# Altium project SLW_2018_V1.PrjPcb
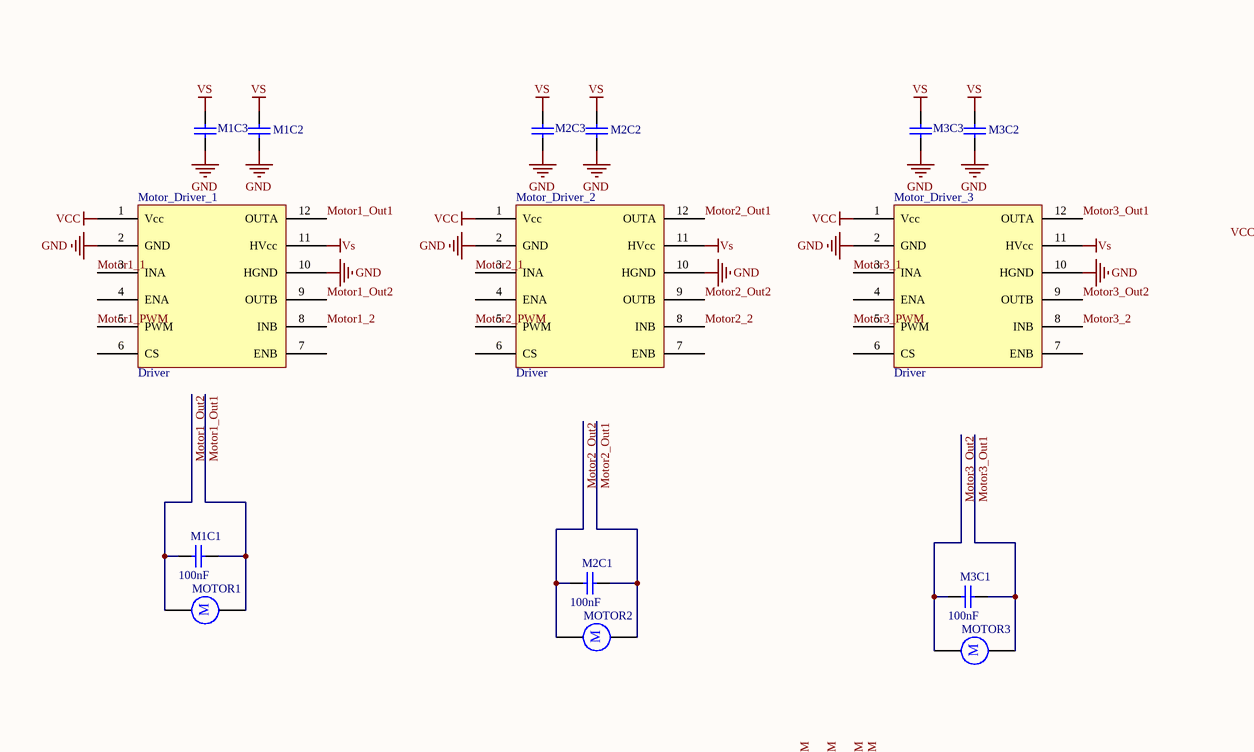
[diagram p0: SLW_2018_V1.SchDoc, top left]
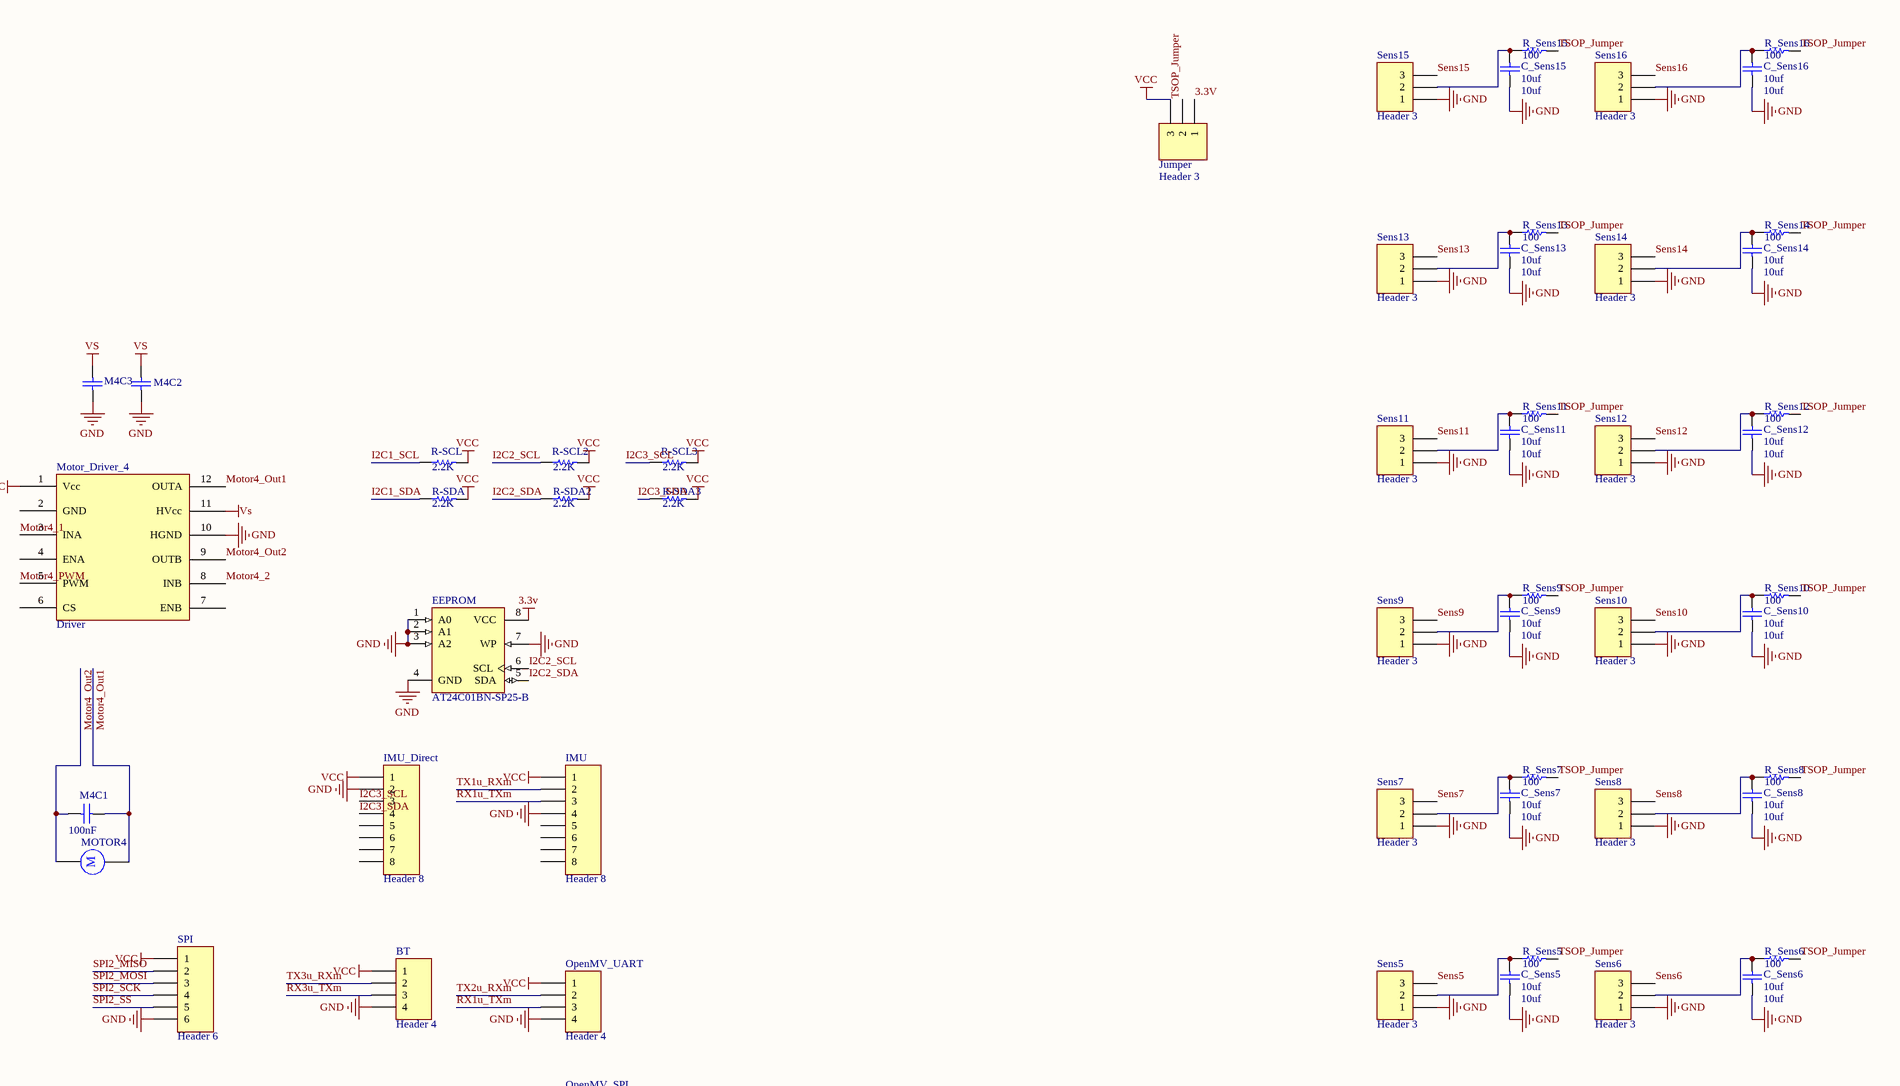
[diagram p1: SLW_2018_V1.SchDoc, top right]
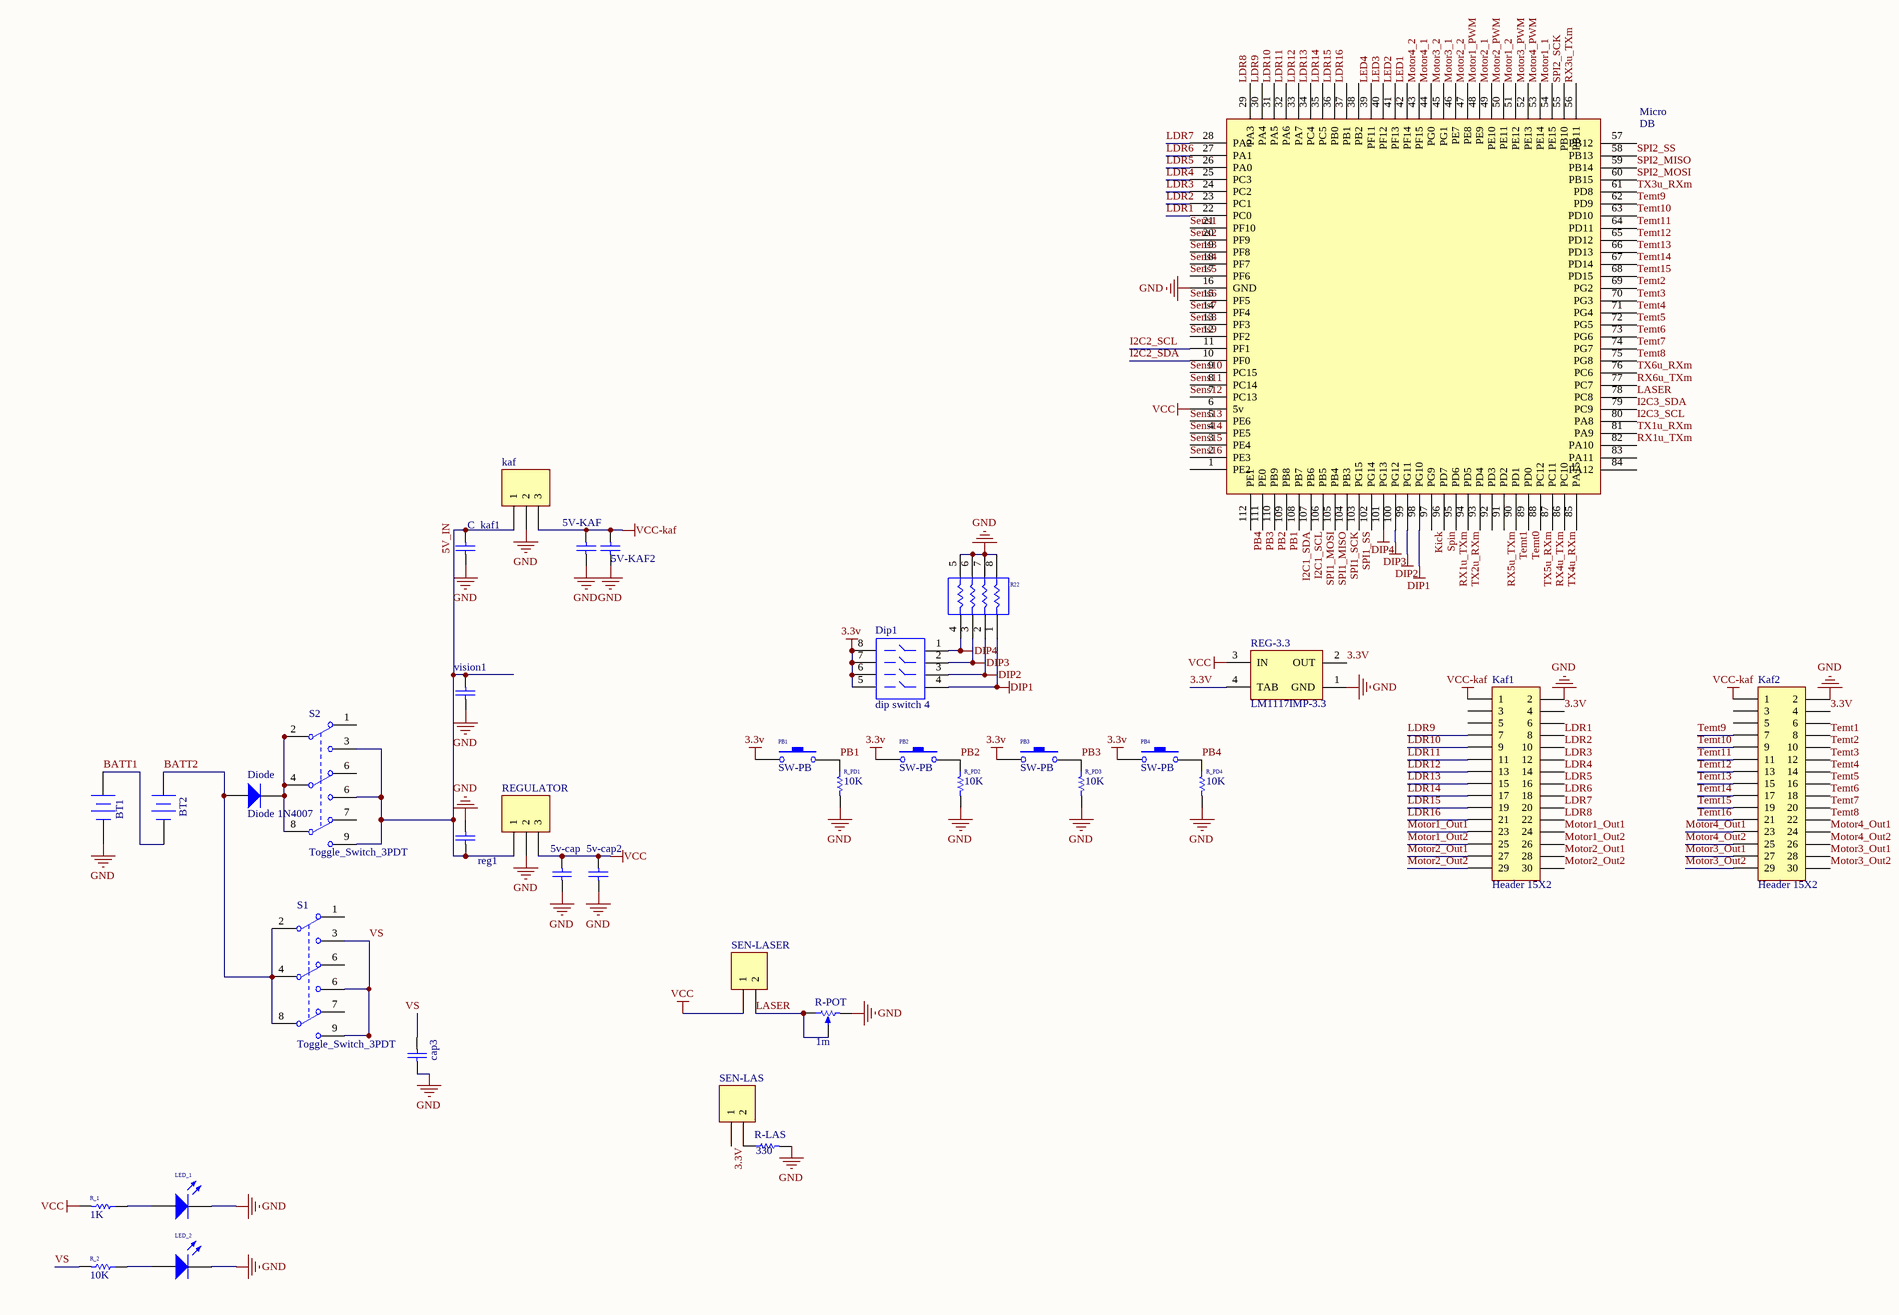
[diagram p2: SLW_2018_V1.SchDoc, bottom left]
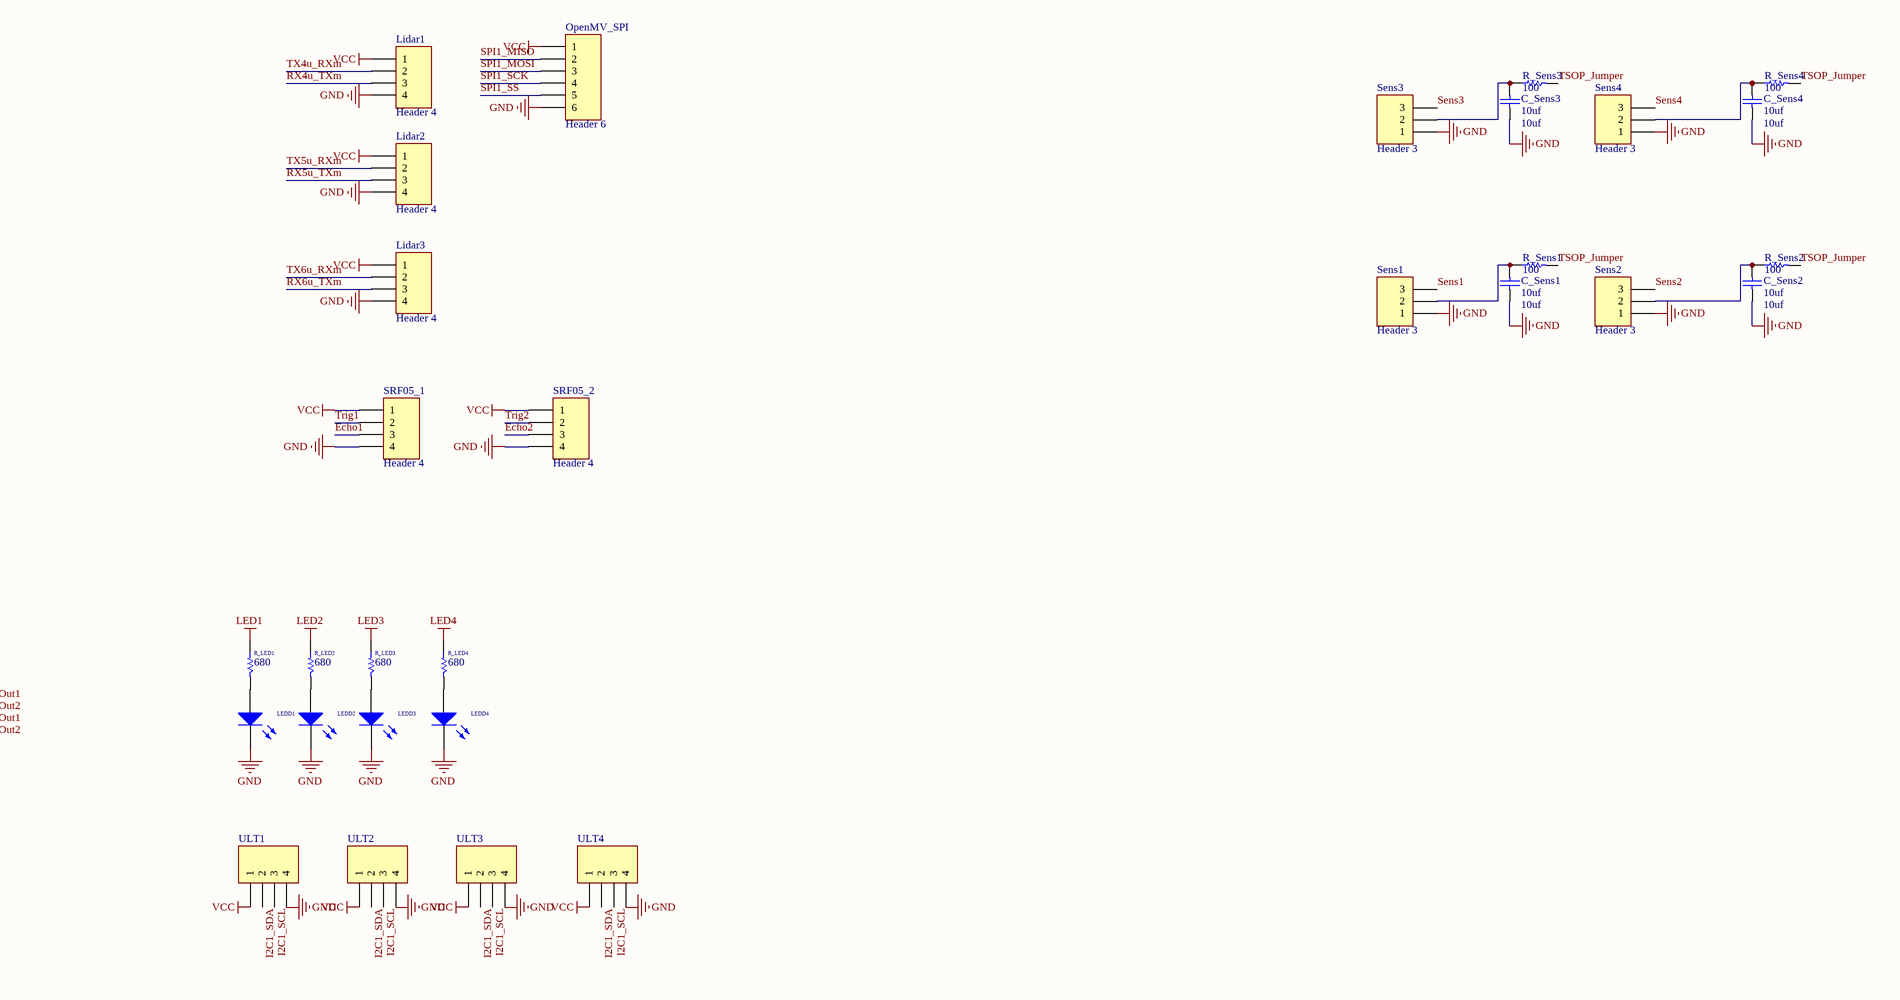
[diagram p3: SLW_2018_V1.SchDoc, bottom right]
1 sheet, 136 parts. Net scope: global (net labels, ports and power ports of the same name join across sheets).
Board file: SLW_2018_V1.PcbDoc

## Sheet SLW_2018_V1.SchDoc
size A1

### Parts
5v-cap  Cap  [c100_63v]  (value not drawn)
5v-cap2  Cap Semi  [805]  (value not drawn)
5V-KAF  Cap  [c100_63v]  (value not drawn)
5V-KAF2  Cap Semi  [805]  (value not drawn)
BT  Header 4  [Round4]
BT1  Battery  [XT60]  (value not drawn)
BT2  Battery  [XT60]  (value not drawn)
C_kaf1  Cap Semi  [805]  (value not drawn)
C_Sens1  10uf  [805]
C_Sens2  10uf  [805]
C_Sens3  10uf  [805]
C_Sens4  10uf  [805]
C_Sens5  10uf  [805]
C_Sens6  10uf  [805]
C_Sens7  10uf  [805]
C_Sens8  10uf  [805]
C_Sens9  10uf  [805]
C_Sens10  10uf  [805]
C_Sens11  10uf  [805]
C_Sens12  10uf  [805]
C_Sens13  10uf  [805]
C_Sens14  10uf  [805]
C_Sens15  10uf  [805]
C_Sens16  10uf  [805]
cap3  Cap  [C1000uf50v]  (value not drawn)
Diode  Diode 1N4007  [STTA806]
Dip1  dip switch 4  [DIPsw4]
EEPROM  AT24C01BN-SP25-B  [8S1_M]
IMU  Header 8  [Round8]
IMU_Direct  Header 8  [Round8]
Jumper  Header 3  [HDR1X3]
kaf  Header 3  [LM2576]  (value not drawn)
Kaf1  Header 15X2  [PHL2X15]
Kaf2  Header 15X2  [PHL2X15]
LED_1  LED Green 0603  [805]  (value not drawn)
LED_2  LED Green 0805  [805]  (value not drawn)
LEDD1  LED Green 0603  [805]  (value not drawn)
LEDD2  LED Green 0603  [805]  (value not drawn)
LEDD3  LED Green 0603  [805]  (value not drawn)
LEDD4  LED Green 0603  [805]  (value not drawn)
Lidar1  Header 4  [Round4]
Lidar2  Header 4  [Round4]
Lidar3  Header 4  [Round4]
M1C1  value 100nF  [C0805]  (hidden comment: Cap Semi)
M1C2  Cap Semi  [C0805]  (value not drawn)
M1C3  Cap Semi  [C1000uf50v]  (value not drawn)
M2C1  value 100nF  [C0805]  (hidden comment: Cap Semi)
M2C2  Cap Semi  [C0805]  (value not drawn)
M2C3  Cap Semi  [C1000uf50v]  (value not drawn)
M3C1  value 100nF  [C0805]  (hidden comment: Cap Semi)
M3C2  Cap Semi  [C0805]  (value not drawn)
M3C3  Cap Semi  [C1000uf50v]  (value not drawn)
M4C1  value 100nF  [C0805]  (hidden comment: Cap Semi)
M4C2  Cap Semi  [C0805]  (value not drawn)
M4C3  Cap Semi  [C1000uf50v]  (value not drawn)
Micro  DB  [DBPCB]
MOTOR1  Motor  [Round2]  (value not drawn)
MOTOR2  Motor  [Round2]  (value not drawn)
MOTOR3  Motor  [Round2]  (value not drawn)
MOTOR4  Motor  [Round2]  (value not drawn)
Motor_Driver_1  Driver  [Driver]
Motor_Driver_2  Driver  [Driver]
Motor_Driver_3  Driver  [Driver]
Motor_Driver_4  Driver  [Driver]
OpenMV_SPI  Header 6  [Round6]
OpenMV_UART  Header 4  [Round4]
PB1  SW-PB  [TactSMD]
PB2  SW-PB  [TactSMD]
PB3  SW-PB  [TactSMD]
PB4  SW-PB  [TactSMD]
R22  10K  [Res_Array]  (value not drawn)
R-LAS  value 330  [805]  (hidden comment: Res1)
R-POT  value 1m  [Multiturn]  (hidden comment: RPot)
R-SCL  value 2.2K  [805]  (hidden comment: Res1)
R-SCL2  value 2.2K  [805]  (hidden comment: Res1)
R-SCL3  value 2.2K  [805]  (hidden comment: Res1)
R-SDA  value 2.2K  [805]  (hidden comment: Res1)
R-SDA2  value 2.2K  [805]  (hidden comment: Res1)
R-SDA3  value 2.2K  [805]  (hidden comment: Res1)
R_1  1K  [805]
R_2  10K  [805]
R_LED1  value 680  [805]  (hidden comment: 680 603)
R_LED2  value 680  [805]  (hidden comment: 680 603)
R_LED3  value 680  [805]  (hidden comment: 680 603)
R_LED4  value 680  [805]  (hidden comment: 680 603)
R_PD1  value 10K  [805]  (hidden comment: 10K 603)
R_PD2  value 10K  [805]  (hidden comment: 10K 603)
R_PD3  value 10K  [805]  (hidden comment: 10K 603)
R_PD4  value 10K  [805]  (hidden comment: 10K 603)
R_Sens1  100  [805]
R_Sens2  100  [805]
R_Sens3  100  [805]
R_Sens4  100  [805]
R_Sens5  100  [805]
R_Sens6  100  [805]
R_Sens7  100  [805]
R_Sens8  100  [805]
R_Sens9  100  [805]
R_Sens10  100  [805]
R_Sens11  100  [805]
R_Sens12  100  [805]
R_Sens13  100  [805]
R_Sens14  100  [805]
R_Sens15  100  [805]
R_Sens16  100  [805]
reg1  Cap  [805]  (value not drawn)
REG-3.3  LM1117IMP-3.3  [MP04A_N]
REGULATOR  Header 3  [LM2576]  (value not drawn)
S1  Toggle_Switch_3PDT  [TS_3dpt]
S2  Toggle_Switch_3PDT  [TS_3dpt]
SEN-LAS  Header 2  [Round2]  (value not drawn)
SEN-LASER  Header 2  [Round2]  (value not drawn)
Sens1  Header 3  [TSOP]
Sens2  Header 3  [TSOP]
Sens3  Header 3  [TSOP]
Sens4  Header 3  [TSOP]
Sens5  Header 3  [TSOP]
Sens6  Header 3  [TSOP]
Sens7  Header 3  [TSOP]
Sens8  Header 3  [TSOP]
Sens9  Header 3  [TSOP]
Sens10  Header 3  [TSOP]
Sens11  Header 3  [TSOP]
Sens12  Header 3  [TSOP]
Sens13  Header 3  [TSOP]
Sens14  Header 3  [TSOP]
Sens15  Header 3  [TSOP]
Sens16  Header 3  [TSOP]
SPI  Header 6  [Round6]
SRF05_1  Header 4  [Round4]
SRF05_2  Header 4  [Round4]
ULT1  Header 4  [Round4]  (value not drawn)
ULT2  Header 4  [Round4]  (value not drawn)
ULT3  Header 4  [Round4]  (value not drawn)
ULT4  Header 4  [Round4]  (value not drawn)
vision1  Cap Semi  [805]  (value not drawn)

### Nets
3.3V: Dip1.5 Dip1.6 Dip1.7 Dip1.8 EEPROM.8(VCC) Jumper.1 Kaf1.4 Kaf2.4 PB1.2 PB2.2 PB3.2 PB4.2 REG-3.3.2(OUT) REG-3.3.4(TAB) SEN-LAS.1
DIP1: Dip1.4 Micro.98(PG10) R22.1
DIP2: Dip1.3 Micro.99(PG11) R22.2
DIP3: Dip1.2 Micro.100(PG12) R22.3
DIP4: Dip1.1 Micro.101(PG13) R22.4
GND: 5v-cap.1 5v-cap2.1 5V-KAF.1 5V-KAF2.1 BT.4 BT1.2(-) C_kaf1.1 C_Sens1.1 C_Sens2.1 C_Sens3.1 C_Sens4.1 C_Sens5.1 C_Sens6.1 C_Sens7.1 C_Sens8.1 C_Sens9.1 C_Sens10.1 C_Sens11.1 C_Sens12.1 C_Sens13.1 C_Sens14.1 C_Sens15.1 C_Sens16.1 cap3.1 EEPROM.1(A0) EEPROM.2(A1) EEPROM.3(A2) EEPROM.4(GND) EEPROM.7(WP) IMU.4 IMU_Direct.2 kaf.2 Kaf1.2 Kaf2.2 LED_1.2(K) LED_2.2(K) LEDD1.2(K) LEDD2.2(K) LEDD3.2(K) LEDD4.2(K) Lidar1.4 Lidar2.4 Lidar3.4 M1C2.1 M1C3.1 M2C2.1 M2C3.1 M3C2.1 M3C3.1 M4C2.1 M4C3.1 Micro.16(GND) Motor_Driver_1.2(GND) Motor_Driver_1.10(HGND) Motor_Driver_2.2(GND) Motor_Driver_2.10(HGND) Motor_Driver_3.2(GND) Motor_Driver_3.10(HGND) Motor_Driver_4.10(HGND) OpenMV_SPI.6 OpenMV_UART.4 R22.5 R22.6 R22.7 R22.8 R-LAS.2 R-POT.2(BOT) R_PD1.2 R_PD2.2 R_PD3.2 R_PD4.2 reg1.2 REG-3.3.1(GND) REGULATOR.2 Sens1.1 Sens2.1 Sens3.1 Sens4.1 Sens5.1 Sens6.1 Sens7.1 Sens8.1 Sens9.1 Sens10.1 Sens11.1 Sens12.1 Sens13.1 Sens14.1 Sens15.1 Sens16.1 SPI.6 SRF05_1.4 SRF05_2.4 ULT1.4 ULT2.4 ULT3.4 ULT4.4 vision1.1
LED1: Micro.42(PF14) R_LED1.1
LED2: Micro.41(PF13) R_LED2.1
LED3: Micro.40(PF12) R_LED3.1
LED4: Micro.39(PF11) R_LED4.1
VCC: 5v-cap.2 5v-cap2.2 BT.1 IMU.1 IMU_Direct.1 Jumper.3 Lidar1.1 Lidar2.1 Lidar3.1 Micro.6(5v) Motor_Driver_1.1(Vcc) Motor_Driver_2.1(Vcc) Motor_Driver_3.1(Vcc) Motor_Driver_4.1(Vcc) OpenMV_SPI.1 OpenMV_UART.1 R-SCL.2 R-SCL2.2 R-SCL3.2 R-SDA.2 R-SDA2.2 R-SDA3.2 R_1.2 REG-3.3.3(IN) REGULATOR.3 SEN-LASER.1 SPI.1 SRF05_1.1 SRF05_2.1 ULT1.1 ULT2.1 ULT3.1 ULT4.1
VCC-kaf: 5V-KAF.2 5V-KAF2.2 kaf.3 Kaf1.1 Kaf2.1
VS: M1C2.2 M1C3.2 M2C2.2 M2C3.2 M3C2.2 M3C3.2 M4C2.2 M4C3.2 Motor_Driver_1.11(HVcc) Motor_Driver_2.11(HVcc) Motor_Driver_3.11(HVcc) Motor_Driver_4.11(HVcc) R_2.2 S1.3(NO1) S1.6(NC2) S1.9(NO2)
5V_IN: C_kaf1.2 kaf.1 reg1.1 REGULATOR.1 S2.3(NO1) S2.6(NC2) S2.9(NO2) vision1.2
BATT1: BT1.1(+) BT2.2(-)
BATT2: BT2.1(+) Diode.1(A) S1.2(COMMON1) S1.4(COMMON2) S1.8(COMMON2)
Echo1: SRF05_1.3
Echo2: SRF05_2.3
I2C1_SCL: Micro.107(PB6) R-SCL.1 ULT1.3 ULT2.3 ULT3.3 ULT4.3
I2C1_SDA: Micro.108(PB7) R-SDA.1 ULT1.2 ULT2.2 ULT3.2 ULT4.2
I2C2_SCL: EEPROM.6(SCL) Micro.11(PF1) R-SCL2.1
I2C2_SDA: EEPROM.5(SDA) Micro.10(PF0) R-SDA2.1
I2C3_SCL: IMU_Direct.3 Micro.80(PA8) R-SCL3.1
I2C3_SDA: IMU_Direct.4 Micro.79(PC9) R-SDA3.1
Kick: Micro.97(PG9)
LASER: Micro.78(PC8) R-POT.1(TOP) R-POT.3(TAP) SEN-LASER.2
LDR1: Kaf1.8 Micro.22(PC0)
LDR2: Kaf1.10 Micro.23(PC1)
LDR3: Kaf1.12 Micro.24(PC2)
LDR4: Kaf1.14 Micro.25(PC3)
LDR5: Kaf1.16 Micro.26(PA0)
LDR6: Kaf1.18 Micro.27(PA1)
LDR7: Kaf1.20 Micro.28(PA2)
LDR8: Kaf1.22 Micro.29(PA3)
LDR9: Kaf1.7 Micro.30(PA4)
LDR10: Kaf1.9 Micro.31(PA5)
LDR11: Kaf1.11 Micro.32(PA6)
LDR12: Kaf1.13 Micro.33(PA7)
LDR13: Kaf1.15 Micro.34(PC4)
LDR14: Kaf1.17 Micro.35(PC5)
LDR15: Kaf1.19 Micro.36(PB0)
LDR16: Kaf1.21 Micro.37(PB1)
Motor1_1: Micro.54(PE15) Motor_Driver_1.3(INA)
Motor1_2: Micro.51(PE12) Motor_Driver_1.8(INB)
Motor1_Out1: Kaf1.23 Kaf1.24 M1C1.2 MOTOR1.2 Motor_Driver_1.12(OUTA)
Motor1_Out2: Kaf1.25 Kaf1.26 M1C1.1 MOTOR1.1 Motor_Driver_1.9(OUTB)
Motor1_PWM: Micro.48(PE9) Motor_Driver_1.5(PWM)
Motor2_1: Micro.49(PE10) Motor_Driver_2.3(INA)
Motor2_2: Micro.47(PE8) Motor_Driver_2.8(INB)
Motor2_Out1: Kaf1.27 Kaf1.28 M2C1.2 MOTOR2.2 Motor_Driver_2.12(OUTA)
Motor2_Out2: Kaf1.29 Kaf1.30 M2C1.1 MOTOR2.1 Motor_Driver_2.9(OUTB)
Motor2_PWM: Micro.50(PE11) Motor_Driver_2.5(PWM)
Motor3_1: Micro.46(PE7) Motor_Driver_3.3(INA)
Motor3_2: Micro.45(PG1) Motor_Driver_3.8(INB)
Motor3_Out1: Kaf2.27 Kaf2.28 M3C1.2 MOTOR3.2 Motor_Driver_3.12(OUTA)
Motor3_Out2: Kaf2.29 Kaf2.30 M3C1.1 MOTOR3.1 Motor_Driver_3.9(OUTB)
Motor3_PWM: Micro.52(PE13) Motor_Driver_3.5(PWM)
Motor4_1: Micro.44(PG0) Motor_Driver_4.3(INA)
Motor4_2: Micro.43(PF15) Motor_Driver_4.8(INB)
Motor4_Out1: Kaf2.23 Kaf2.24 M4C1.2 MOTOR4.2 Motor_Driver_4.12(OUTA)
Motor4_Out2: Kaf2.25 Kaf2.26 M4C1.1 MOTOR4.1 Motor_Driver_4.9(OUTB)
Motor4_PWM: Micro.53(PE14) Motor_Driver_4.5(PWM)
PB1: Micro.109(PB8) PB1.1 R_PD1.1
PB2: Micro.110(PB9) PB2.1 R_PD2.1
PB3: Micro.111(PE0) PB3.1 R_PD3.1
PB4: Micro.112(PE1) PB4.1 R_PD4.1
RX1u_TXm: IMU.3 Micro.82(PA10) Micro.95(PD6) OpenMV_UART.3
RX3u_TXm: BT.3 Micro.56(PB11)
RX4u_TXm: Lidar1.3 Micro.87(PC11)
RX5u_TXm: Lidar2.3 Micro.91(PD2)
RX6u_TXm: Lidar3.3 Micro.77(PC7)
Sens1: Micro.21(PF10) Sens1.3
Sens2: Micro.20(PF9) Sens2.3
Sens3: Micro.19(PF8) Sens3.3
Sens4: Micro.18(PF7) Sens4.3
Sens5: Micro.17(PF6) Sens5.3
Sens6: Micro.15(PF5) Sens6.3
Sens7: Micro.14(PF4) Sens7.3
Sens8: Micro.13(PF3) Sens8.3
Sens9: Micro.12(PF2) Sens9.3
Sens10: Micro.9(PC15) Sens10.3
Sens11: Micro.8(PC14) Sens11.3
Sens12: Micro.7(PC13) Sens12.3
Sens13: Micro.5(PE6) Sens13.3
Sens14: Micro.4(PE5) Sens14.3
Sens15: Micro.3(PE4) Sens15.3
Sens16: Micro.2(PE3) Sens16.3
SPI1_MISO: Micro.105(PB4) OpenMV_SPI.2
SPI1_MOSI: Micro.106(PB5) OpenMV_SPI.3
SPI1_SCK: Micro.104(PB3) OpenMV_SPI.4
SPI1_SS: Micro.103(PG15) OpenMV_SPI.5
SPI2_MISO: Micro.59(PB14) SPI.2
SPI2_MOSI: Micro.60(PB15) SPI.3
SPI2_SCK: Micro.55(PB10) SPI.4
SPI2_SS: Micro.58(PB13) SPI.5
Spin: Micro.96(PD7)
Temt0: Micro.89(PD0)
Temt1: Kaf2.8 Micro.90(PD1)
Temt2: Kaf2.10 Micro.69(PG2)
Temt3: Kaf2.12 Micro.70(PG3)
Temt4: Kaf2.14 Micro.71(PG4)
Temt5: Kaf2.16 Micro.72(PG5)
Temt6: Kaf2.18 Micro.73(PG6)
Temt7: Kaf2.20 Micro.74(PG7)
Temt8: Kaf2.22 Micro.75(PG8)
Temt9: Kaf2.7 Micro.62(PD9)
Temt10: Kaf2.9 Micro.63(PD10)
Temt11: Kaf2.11 Micro.64(PD11)
Temt12: Kaf2.13 Micro.65(PD12)
Temt13: Kaf2.15 Micro.66(PD13)
Temt14: Kaf2.17 Micro.67(PD14)
Temt15: Kaf2.19 Micro.68(PD15)
Temt16: Kaf2.21
Trig1: SRF05_1.2
Trig2: SRF05_2.2
TSOP_Jumper: Jumper.2 R_Sens1.2 R_Sens2.2 R_Sens3.2 R_Sens4.2 R_Sens5.2 R_Sens6.2 R_Sens7.2 R_Sens8.2 R_Sens9.2 R_Sens10.2 R_Sens11.2 R_Sens12.2 R_Sens13.2 R_Sens14.2 R_Sens15.2 R_Sens16.2
TX1u_RXm: IMU.2 Micro.81(PA9)
TX2u_RXm: Micro.94(PD5) OpenMV_UART.2
TX3u_RXm: BT.2 Micro.61(PD8)
TX4u_RXm: Lidar1.2 Micro.86(PC10)
TX5u_RXm: Lidar2.2 Micro.88(PC12)
TX6u_RXm: Lidar3.2 Micro.76(PC6)
NetC_Sens1_2: C_Sens1.2 R_Sens1.1 Sens1.2
NetC_Sens2_2: C_Sens2.2 R_Sens2.1 Sens2.2
NetC_Sens3_2: C_Sens3.2 R_Sens3.1 Sens3.2
NetC_Sens4_2: C_Sens4.2 R_Sens4.1 Sens4.2
NetC_Sens5_2: C_Sens5.2 R_Sens5.1 Sens5.2
NetC_Sens6_2: C_Sens6.2 R_Sens6.1 Sens6.2
NetC_Sens7_2: C_Sens7.2 R_Sens7.1 Sens7.2
NetC_Sens8_2: C_Sens8.2 R_Sens8.1 Sens8.2
NetC_Sens9_2: C_Sens9.2 R_Sens9.1 Sens9.2
NetC_Sens10_2: C_Sens10.2 R_Sens10.1 Sens10.2
NetC_Sens11_2: C_Sens11.2 R_Sens11.1 Sens11.2
NetC_Sens12_2: C_Sens12.2 R_Sens12.1 Sens12.2
NetC_Sens13_2: C_Sens13.2 R_Sens13.1 Sens13.2
NetC_Sens14_2: C_Sens14.2 R_Sens14.1 Sens14.2
NetC_Sens15_2: C_Sens15.2 R_Sens15.1 Sens15.2
NetC_Sens16_2: C_Sens16.2 R_Sens16.1 Sens16.2
NetDiode_2: Diode.2(K) S2.2(COMMON1) S2.4(COMMON2) S2.8(COMMON2)
NetLED_1_1: LED_1.1(A) R_1.1
NetLED_2_1: LED_2.1(A) R_2.1
NetLEDD1_1: LEDD1.1(A) R_LED1.2
NetLEDD2_1: LEDD2.1(A) R_LED2.2
NetLEDD3_1: LEDD3.1(A) R_LED3.2
NetLEDD4_1: LEDD4.1(A) R_LED4.2
NetR-LAS_1: R-LAS.1 SEN-LAS.2

Not connected (* = marked no-connect by the designer): cap3 2; IMU 5 6 7 8; IMU_Direct 5 6 7 8; Kaf1 3 5 6; Kaf2 3 5 6; Micro 1(PE2) 38(PB2) 57(PB12) 83(PA11) 84(PA12) 85(PA15) 92(PD3) 93(PD4) 102(PG14); Motor_Driver_1 4(ENA) 6(CS) 7(ENB); Motor_Driver_2 4(ENA) 6(CS) 7(ENB); Motor_Driver_3 4(ENA) 6(CS) 7(ENB); Motor_Driver_4 2(GND) 4(ENA) 6(CS) 7(ENB); S1 1(NC1) 7(NC2); S2 1(NC1) 7(NC2)

### Notes on the sheet
- Labels drawn without touching a wire or pin: VS
- (in symbol Motor) M

### Library data of the parts
5v-cap 5V-KAF cap3 reg1 = Cap: Capacitor; Value: 6800uf; Published: 8-Jun-2000; LatestRevisionDate: 17-Jul-2002; LatestRevisionNote: Re-released for DXP Platform.; PackageReference: RAD-0.3; Publisher: Altium Limited
5v-cap2 5V-KAF2 C_kaf1 M1C2 M1C3 M2C2 M2C3 M3C2 M3C3 M4C2 M4C3 vision1 = Cap Semi: Capacitor (Semiconductor SIM Model); Value: 100nF; Published: 8-Jun-2000; LatestRevisionDate: 17-Jul-2002; LatestRevisionNote: Re-released for DXP Platform.; PackageReference: C1206; Publisher: Altium Limited
BT Lidar1-Lidar3 OpenMV_UART SRF05_1 SRF05_2 ULT1-ULT4 = Header 4: Header, 4-Pin; LatestRevisionDate: 17-Jul-2002; LatestRevisionNote: Re-released for DXP Platform.; Publisher: Altium Limited
BT1 BT2 = Battery: Multicell Battery; Published: 24-Mar-1999; LatestRevisionDate: 17-Jul-2002; LatestRevisionNote: Re-released for DXP Platform.; PackageReference: BAT-2; Publisher: Altium Limited
C_Sens1-C_Sens16 = Cap: Capacitor; Published: 8-Jun-2000; LatestRevisionDate: 17-Jul-2002; LatestRevisionNote: Re-released for DXP Platform.; PackageReference: RAD-0.3; Publisher: Altium Limited; PackageDescription: Radial Cap, Thru-Hole; 2 Leads; 0.3 in Pin Spacing; Value: 10uf
Diode = Diode 1N4007: 1 Amp General Purpose Rectifier; Published: 8-Jun-2000; LatestRevisionDate: 17-Jul-2002; LatestRevisionNote: Re-released for DXP Platform.; DatasheetDocument: 1998; PackageDocument: Aug-1999; PackageReference: DO-41; Publisher: Altium Limited; Code_JEDEC: DO-204-AL; ComponentLink1Description: Manufacturer Link; ComponentLink1URL: http://www.fairchildsemi.com/; ComponentLink2Description: Datasheet; ComponentLink2URL: http://www.fairchildsemi.com/ds/1N%2F1N4001.pdf
Dip1 = SW-DIP4: DIP Switch; Published: 24-Mar-1999; LatestRevisionDate: 17-Jul-2002; LatestRevisionNote: Re-released for DXP Platform.; PackageReference: DIP-8; Publisher: Altium Limited
EEPROM = AT24C01BN-SP25-B: 1Kbit (128 x 8), 2-wire Bus Automotive Serial EEPROM with Write Protect, 2.5V, 8-Pin SOIC, Bulk; DatasheetVersion: 8517C,  Jan-2009; PackageVersion: revC, Mar-2005; PackageReference: 8S1; PackageDescription: 8-Lead (0.150" Wide Body), Plastic Gull Wing Small Outline (JEDEC SOIC); Code_JEDEC: MS-012-AA; Code_IPC: SOIC127P600-8; ComponentLink1Description: Manufacturer URL; ComponentLink1URL: http://www.atmel.com/; ComponentLink2Description: Datasheet; ComponentLink2URL: http://www.atmel.com/dyn/resources/prod_documents/doc8517.pdf
IMU IMU_Direct = Header 8: Header, 8-Pin; LatestRevisionDate: 17-Jul-2002; LatestRevisionNote: Re-released for DXP Platform.; Publisher: Altium Limited
Jumper kaf REGULATOR Sens1-Sens16 = Header 3: Header, 3-Pin; LatestRevisionDate: 17-Jul-2002; LatestRevisionNote: Re-released for DXP Platform.; Publisher: Altium Limited
Kaf1 Kaf2 = Header 15X2: Header, 15-Pin, Dual row; LatestRevisionDate: 17-Jul-2002; LatestRevisionNote: Re-released for DXP Platform.; Publisher: Altium Limited
LED_1 LED_2 LEDD1-LEDD4 = LED0: Typical INFRARED GaAs LED; Published: 8-Jun-2000; Revision: July-2002: Re-released for DXP Platform.; Publisher: Altium Limited
M1C1 M2C1 M3C1 M4C1 = Cap Semi: Capacitor (Semiconductor SIM Model); Published: 8-Jun-2000; LatestRevisionDate: 17-Jul-2002; LatestRevisionNote: Re-released for DXP Platform.; PackageReference: C1206; Publisher: Altium Limited
MOTOR1-MOTOR4 = Motor: Motor, General Kind; Published: 24-Mar-1999; LatestRevisionDate: 17-Jul-2002; LatestRevisionNote: Re-released for DXP Platform.; PackageReference: RB5-10.5; Publisher: Altium Limited
OpenMV_SPI SPI = Header 6: Header, 6-Pin; LatestRevisionDate: 17-Jul-2002; LatestRevisionNote: Re-released for DXP Platform.; Publisher: Altium Limited
PB1-PB4 = SW-PB: Switch; Published: 24-Mar-1999; Revision: July-2002: Re-released for DXP Platform.; Publisher: Altium Limited
R22 = Res Array 4
R-LAS R-SCL R-SCL2 R-SCL3 R-SDA R-SDA2 R-SDA3 R_Sens1-R_Sens16 = Res1: Resistor; Published: 8-Jun-2000; LatestRevisionDate: 17-Jul-2002; LatestRevisionNote: Re-released for DXP Platform.; PackageReference: AXIAL-0.3; Publisher: Altium Limited
  R_Sens1-R_Sens16: Value: 100
R-POT = RPot: Potentiometer; Sim Note: Enter the Resistance value and the set point into parameter fields.; Set Position: 0.5; Published: 8-Jun-2000; LatestRevisionDate: 17-Jul-2002; LatestRevisionNote: Re-released for DXP Platform.; PackageReference: VR5; Publisher: Altium Limited
R_1 R_2 R_LED1-R_LED4 R_PD1-R_PD4 = res1: Resistor; Published: 8-Jun-2000; LatestRevisionDate: 17-Jul-2002; LatestRevisionNote: Re-released for DXP Platform.; PackageReference: AXIAL-0.3; Publisher: Altium Limited
  R_1: Value: 1K
  R_2: Value: 10K
REG-3.3 = LM1117IMP-3.3: 800mA Low-Dropout Linear Regulator, 4-pin SOT-223; Manufacturer: National Semiconductor; PackageTopMarking: XYTT*N05B; PowerWise: N; CompType: LDO IC; High-Reliability: Y; DatasheetVersion: Apr-2006; PackageVersion: revB, Apr-2003; PackageReference: MP04A; PackageDescription: Molded SOT-223, 6.50 x 3.56 x 1.6mm Body, 4 Lead, 2.3mm Pitch; PartNumber: LM1117IMP-3.3; RoHS: N; PinCount: 4; Code_JEDEC: TO-261-AA; Code_IPC: SOT223-4; ComponentLink1Description: Manufacturer URL; ComponentLink1URL: http://www.national.com/; ComponentLink2Description: LM1117 Datasheet; ComponentLink2URL: http://www.national.com/ds/LM/LM1117.pdf; ComponentLink3Description: LM1117 Web Page; ComponentLink3URL: http://www.national.com/pf/LM/LM1117.html; ComponentLink4Description: MP04A Package Page; ComponentLink4URL: http://www.national.com/packaging/folders/mp04a.html
SEN-LAS SEN-LASER = Header 2: Header, 2-Pin; LatestRevisionDate: 17-Jul-2002; LatestRevisionNote: Re-released for DXP Platform.; Publisher: Altium Limited